# Altium schematic sheet ESC.SchDoc
size A4; SheetNumber: 3; SheetTotal: 6
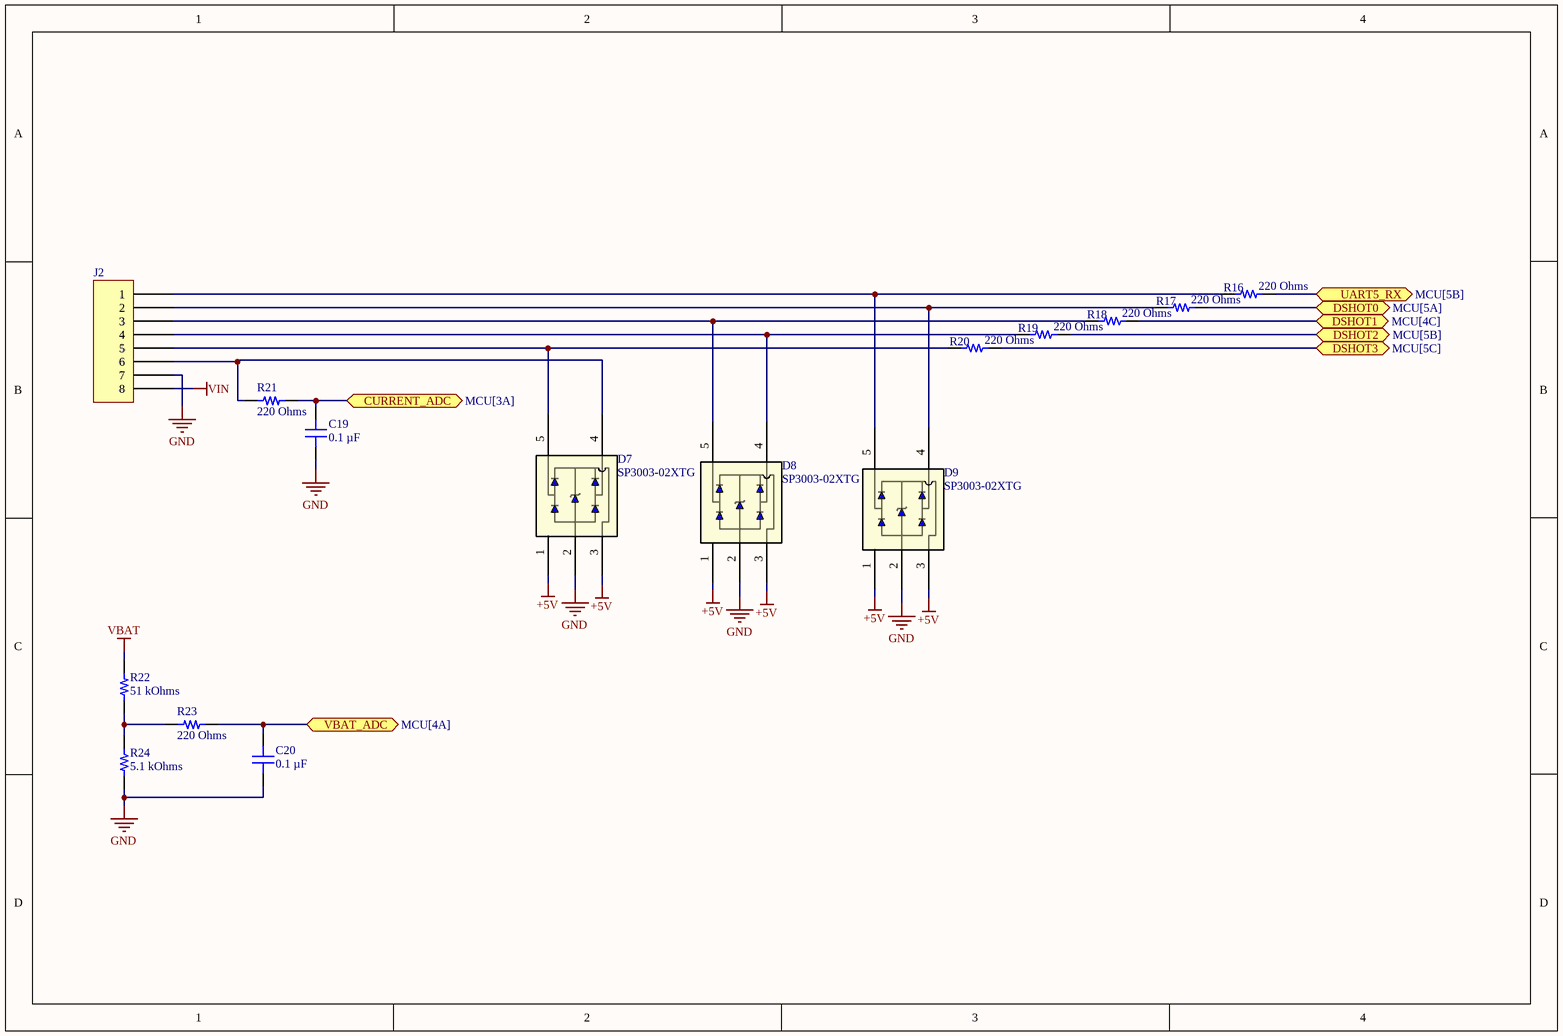
[diagram p0: ESC.SchDoc]

## Parts
C19  0.1 µF  [CAP 0402_1005]
C20  0.1 µF  [CAP 0402_1005]
D7  SP3003-02XTG  [SP3003-02XTG]
D8  SP3003-02XTG  [SP3003-02XTG]
D9  SP3003-02XTG  [SP3003-02XTG]
J2  SM08B-SRSS-TB(LF)(SN)  [JST SM08B-SRSS-TB]  (value not drawn)
R16  220 Ohms  [YAGEO RES 0402_1005]
R17  220 Ohms  [YAGEO RES 0402_1005]
R18  220 Ohms  [YAGEO RES 0402_1005]
R19  220 Ohms  [YAGEO RES 0402_1005]
R20  220 Ohms  [YAGEO RES 0402_1005]
R21  220 Ohms  [YAGEO RES 0402_1005]
R22  51 kOhms  [RES 0603_1608]
R23  220 Ohms  [YAGEO RES 0402_1005]
R24  5.1 kOhms  [RES 0603_1608]

## Ports
CURRENT_ADC (bidir, see MCU[3A]), DSHOT0 (bidir, see MCU[5A]), DSHOT1 (bidir, see MCU[4C]), DSHOT2 (bidir, see MCU[5B]), DSHOT3 (bidir, see MCU[5C]), UART5_RX (bidir, see MCU[5B]), VBAT_ADC (bidir, see MCU[4A])

## Nets
+5V: D7.1 D7.3 D8.1 D8.3 D9.1 D9.3
GND: C19.2 C20.1 D7.2 D8.2 D9.2 J2.7 R24.1
VBAT: R22.2
VIN: J2.8
CURRENT_ADC: C19.1 R21.1 ; port CURRENT_ADC
DSHOT0: R17.2 ; port DSHOT0
DSHOT1: R18.2 ; port DSHOT1
DSHOT2: R19.2 ; port DSHOT2
DSHOT3: R20.2 ; port DSHOT3
UART5_RX: R16.2 ; port UART5_RX
VBAT_ADC: C20.2 R23.2 ; port VBAT_ADC
NetD7_4: D7.4 J2.6 R21.2
NetD7_5: D7.5 J2.5 R20.1
NetD8_4: D8.4 J2.4 R19.1
NetD8_5: D8.5 J2.3 R18.1
NetD9_4: D9.4 J2.2 R17.1
NetD9_5: D9.5 J2.1 R16.1
NetR22_1: R22.1 R23.1 R24.2

## Library data of the parts
C19 C20 = CGA2B3X7R1E104K050BB: CAP CER 0.1UF 25V X7R 0402; manufacturer: TDK Corporation; Tolerance: ±10%; Part Number: CGA2B3X7R1E104K050BB; Capacitance: 0.1 µF; Applications: Automotive; componentlink1description: Datasheet; componentlink1url: https://product.tdk.com/info/en/catalog/datasheets/mlcc_automotive_general_en.pdf?ref_disty=digikey; componentlink2description: DigiKey Link; componentlink2url: https://www.digikey.com/en/products/detail/tdk-corporation/CGA2B3X7R1E104K050BB/2672795; Device Package: 0402 (1005 Metric); lastupdated: 9.02.2024 20:04:35; Lifecycle Status: Active; Minimum Order: 1; Mounting Type: Surface Mount, MLCC; Operating Temperature: -55°C ~ 125°C; Package / Case: 0402 (1005 Metric); packaging: TapeAndReel; partid: 3195; Part Status: Active; price: 0.01; Ratings: AEC-Q200; series: CGA; Size / Dimension: 0.039" L x 0.020" W (1.00mm x 0.50mm); Supplier 1: DigiKey; Supplier Part Number 1: 445-6902-1-ND; Temperature Coefficient: X7R; Thickness (Max): 0.022" (0.55mm); value: 0.1 µF; Voltage - Rated: 25V
D7-D9 = SP3003-02XTG: 15V Clamp 2.5A (8/20µs) Ipp Tvs Diode Surface Mount SOT-553; Manufacturer: Littelfuse Inc.; Unidirectional Channels: 2; Voltage - Reverse Standoff (Typ): 6V (Max); Power Line Protection: Yes; ComponentLink1Description: Datasheet; ComponentLink1URL: https://www.littelfuse.com/assetdocs/littelfuse-tvs-diode-array-sp3003-datasheet?assetguid=217bd10c-e1c8-4a7b-a2f5-64d7294c8270; ComponentLink2Description: Digikey Link; ComponentLink2URL: https://www.digikey.com/en/products/detail/littelfuse-inc/sp3003-02xtg/2024614; Voltage - Clamping (Max) @ Ipp: 15V; Current - Peak Pulse (10/1000µs): 2.5A (8/20µs); Operating Temperature: -40°C ~ 125°C (TJ); Package / Case: SOT-553
J2 = SM08B-SRSS-TB(LF)(SN): CONN HEADER SMD R/A 8POS 1MM; Manufacturer: JST Sales America Inc.; Current Rating (Amps): 0.7A; Material Flammability Rating: UL94 V-0; Number of Positions: 8; Number of Positions Loaded: All; Pitch - Mating: 0.039" (1.00mm); Shrouding: Shrouded - 4 Wall; Style: Board to Cable/Wire; Voltage Rating: 50V; Part Number: SM08B-SRSS-TB(LF)(SN); ComponentLink1Description: Datasheet; ComponentLink1URL: http://www.jst-mfg.com/product/pdf/eng/eSH.pdf; ComponentLink2Description: DigiKey Link; ComponentLink2URL: http://digikey.com/product-detail/en/jst-sales-america-inc/SM08B-SRSS-TB-LF-SN/455-1808-1-ND/926879; Connector Type: Header; Contact Finish - Mating: Tin; Contact Finish - Post: Tin; Contact Material: Copper Alloy; Contact Shape: Square; Contact Type: Male Pin; Fastening Type: Push-Pull; Features: Solder Retention; Insulation Color: Natural; Insulation Height: 0.114" (2.90mm); Insulation Material: Polyamide (PA), Nylon; LastUpdated: 12.01.2020 23:42:39; Lifecycle Status: Active; Minimum Order: 1; Mounting Type: Surface Mount, Right Angle; Number of Rows: 1; Operating Temperature: -25°C ~ 85°C; Packaging: TapeAndReel; PartId: 66; Part Status: Active; Price: 0.41; Series: SR; Supplier 1: DigiKey; Supplier Part Number 1: 455-1808-1-ND; Termination: Solder
R16-R21 R23 = AC0402JR-07220RL: RES SMD 220 OHM 5% 1/16W 0402; Manufacturer: Yageo; Power (Watts): 0.063W, 1/16W; Temperature Coefficient: ±100ppm/°C; Part Number: AC0402JR-07220RL; Value: 220 Ohms; ComponentLink1Description: Datasheet; ComponentLink1URL: https://www.yageo.com/upload/media/product/productsearch/datasheet/rchip/PYu-AC_51_RoHS_L_7.pdf; ComponentLink2Description: DigiKey Link; ComponentLink2URL: https://www.digikey.com/en/products/detail/yageo/AC0402JR-07220RL/5895623; Composition: Thick Film; Device Package: 0402 (1005 Metric); Features: Automotive AEC-Q200, Moisture Resistant; Height - Seated (Max): 0.015" (0.37mm); LastUpdated: 25.07.2024 09:18:15; Lifecycle Status: Active; Minimum Order: 1; Number of Terminations: 2; Operating Temperature: -55°C ~ 155°C; Package / Case: 0402 (1005 Metric); Packaging: CutTape; PartId: 9267; Part Status: Active; Price: 0.01; Ratings: AEC-Q200; Resistance: 220 Ohms; Series: AC; Size / Dimension: 0.039" L x 0.020" W (1.00mm x 0.50mm); Supplier 1: DigiKey; Supplier Part Number 1: YAG3531CT-ND; Supplier Device Package: 0402; Tolerance: ±5%
R22 = CRCW060351K0FKEAHP: RES SMD 51K OHM 1% 1/3W 0603; Manufacturer: Vishay Dale; Power (Watts): 0.333W, 1/3W; Temperature Coefficient: ±100ppm/°C; Part Number: CRCW060351K0FKEAHP; Value: 51 kOhms; ComponentLink1Description: Datasheet; ComponentLink1URL: https://www.vishay.com/docs/20043/crcwhpe3.pdf; ComponentLink2Description: DigiKey Link; ComponentLink2URL: https://www.digikey.com/en/products/detail/vishay-dale/CRCW060351K0FKEAHP/2226362; Composition: Thick Film; Device Package: 0603 (1608 Metric); Features: Automotive AEC-Q200, Pulse Withstanding; Height - Seated (Max): 0.022" (0.55mm); LastUpdated: 9.02.2024 20:41:01; Lifecycle Status: Active; Minimum Order: 1; Number of Terminations: 2; Operating Temperature: -55°C ~ 155°C; Package / Case: 0603 (1608 Metric); Packaging: TapeAndReel; PartId: 71937; Part Status: Active; Price: 0.02; Ratings: AEC-Q200; Resistance: 51 kOhms; Series: CRCW-HP; Size / Dimension: 0.063" L x 0.033" W (1.60mm x 0.85mm); Supplier 1: DigiKey; Supplier Part Number 1: 541-CRCW060351K0FKEAHPCT-ND; Supplier Device Package: 0603; Tolerance: ±1%
R24 = ERJ-PA3F5101V: RES SMD 5.1K OHM 1% 1/3W 0603; Manufacturer: Panasonic Electronic Components; Power (Watts): 0.333W, 1/3W; Temperature Coefficient: ±100ppm/°C; Part Number: ERJ-PA3F5101V; Value: 5.1 kOhms; ComponentLink1Description: Datasheet; ComponentLink1URL: https://industrial.panasonic.com/cdbs/www-data/pdf/RDO0000/AOA0000C331.pdf; ComponentLink2Description: DigiKey Link; ComponentLink2URL: https://www.digikey.com/en/products/detail/panasonic-electronic-components/ERJ-PA3F5101V/5035934; Composition: Thick Film; Device Package: 0603 (1608 Metric); Features: Automotive AEC-Q200, Pulse Withstanding; Height - Seated (Max): 0.022" (0.55mm); LastUpdated: 9.02.2024 20:42:58; Lifecycle Status: Active; Minimum Order: 1; Number of Terminations: 2; Operating Temperature: -55°C ~ 155°C; Package / Case: 0603 (1608 Metric); Packaging: TapeAndReel; PartId: 14704; Part Status: Active; Price: 0.01; Ratings: AEC-Q200; Resistance: 5.1 kOhms; Series: ERJ-PA3; Size / Dimension: 0.063" L x 0.031" W (1.60mm x 0.80mm); Supplier 1: DigiKey; Supplier Part Number 1: P5.1KBYCT-ND; Supplier Device Package: 0603; Tolerance: ±1%